# Altium project Backend.PrjPcb
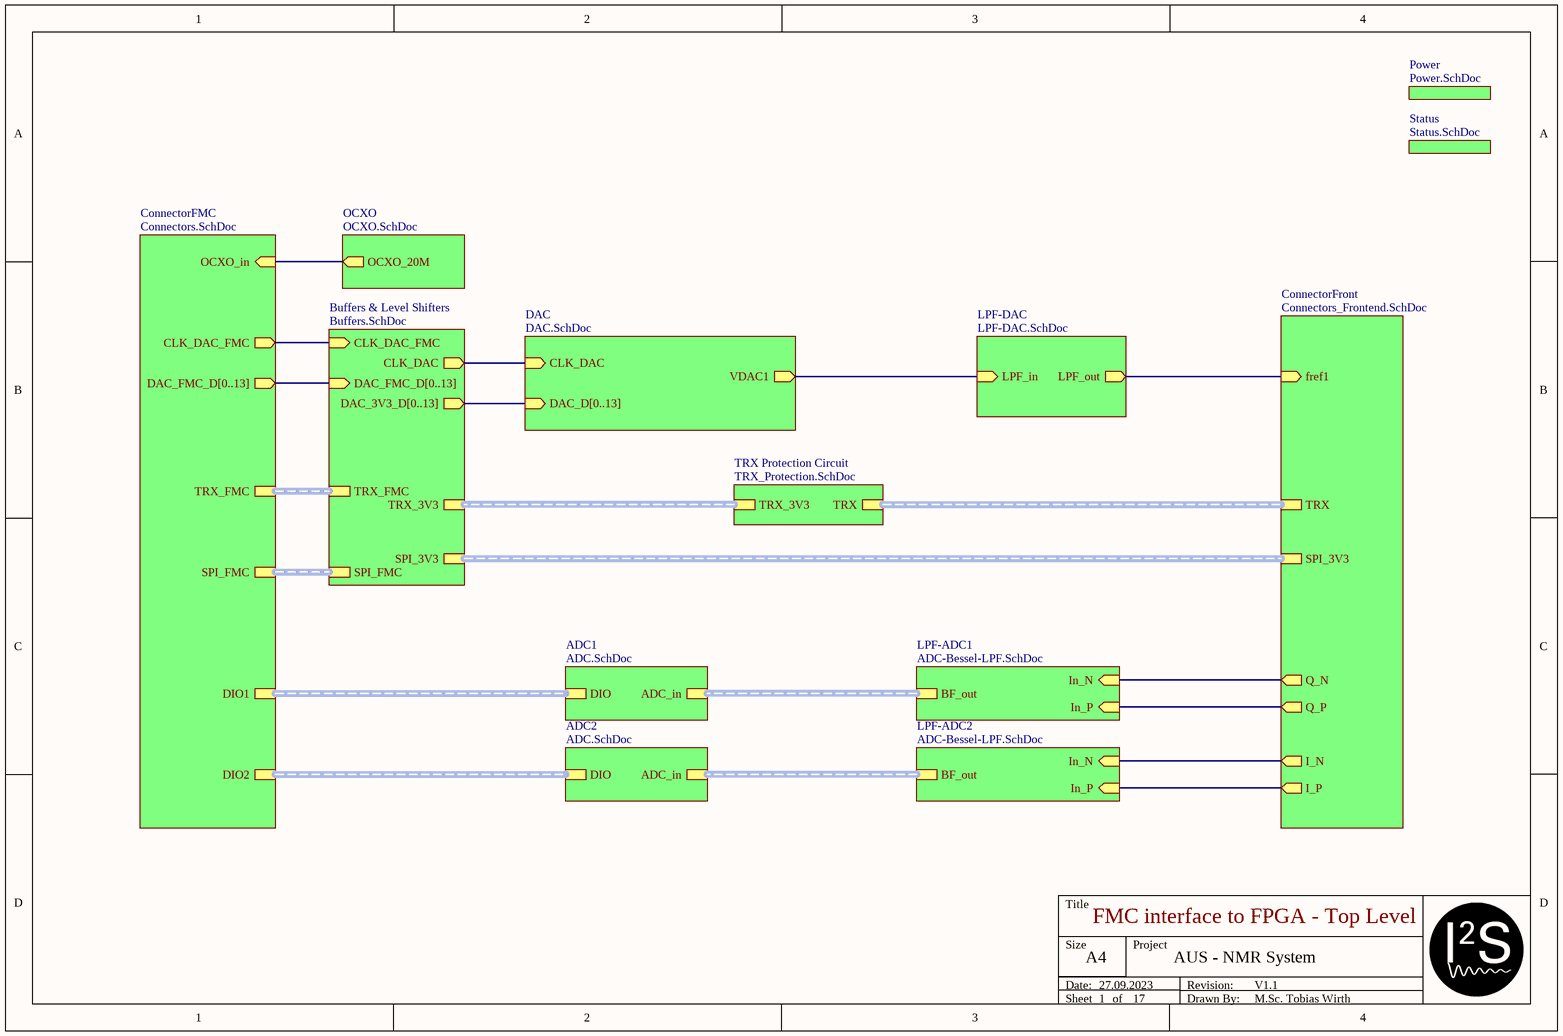
[diagram p0: Top_Level.SchDoc]
CAGE_CODE: ?????; CONTRACT_NUMBER: <CONTRACT NO>; DOC_NO_ASSY_DWG: <ASSY DWG NO>; DOC_NO_BOM: <BOM DOC NO>; DOC_NO_FAB_DWG: <FAB DWG NO>; DOC_NO_SCH_DWG: <SCH DWG NO>; PCB_2_DEC_TOL: +/-.01; PCB_3_DEC_TOL: +/-.010; PCB_ANG_TOL: +/-1/2; PCB_ASSEMBLY_NO: <PCB ASSY NO>; PCB_CHECKER: - -----; PCB_CHECKER_APP_DATE: --/--/----; PCB_DESIGNER: - -----; PCB_DESIGNER_APP_DATE: --/--/----; PCB_DWG_NO: <PCB DWG NO>; PCB_ENGINEER: - -----; PCB_ENGINEER_APP_DATE: --/--/----; PCB_PART_NUMBER: <PCB PN>; PCB_REV: A; SCH_REV: A
9 sheets, 192 parts. Net scope: hierarchical (ports join the sheet entries above them; power ports are global).
Board files: Backend_v2.PcbDoc, Backend_v3.PcbDoc
Sheets:
  Top_Level.SchDoc
    DAC = DAC.SchDoc
    ConnectorFront = Connectors_Frontend.SchDoc
    LPF-ADC2 = ADC-Bessel-LPF.SchDoc
    LPF-ADC1 = ADC-Bessel-LPF.SchDoc
    ADC2 = ADC.SchDoc
    ADC1 = ADC.SchDoc
    Buffers & Level Shifters = Buffers.SchDoc
  DAC-Butterworth-LPF.SchDoc
  DAC-Bessel-LPF.SchDoc
  Power_FE.SchDoc

## Sheet Top_Level.SchDoc: FMC interface to FPGA - Top Level
size A4; Date: 27.09.2023; ApprovedBy: M.Sc. Tobias Wirth; CheckedBy: M.Sc. Tobias Wirth; Author: M.Sc. Tobias Wirth; CompanyName: University of Stuttgart; DrawnBy: M.Sc. Tobias Wirth; Engineer: M.Sc. Tobias Wirth; Organization: IIS; Address1: Pfaffenwaldring 47; Address2: 70569 Stuttgart; Revision: V1.1; SheetNumber: 1; SheetTotal: 17; ProjectNameAlt: AUS - NMR System; Time: 10:00; ImagePath: N/A; Application_BuildNumber: N/A

### Sub-sheets
ADC1 = ADC.SchDoc: DIO (harness DIO), ADC_in (harness ADC_IN)
ADC2 = ADC.SchDoc: DIO (harness DIO), ADC_in (harness ADC_IN)
Buffers & Level Shifters = Buffers.SchDoc: DAC_FMC_D[0..13] (in), CLK_DAC_FMC (in), TRX_FMC (harness TRX_FMC), SPI_FMC (harness SPI_FMC), CLK_DAC (out), DAC_3V3_D[0..13] (out), TRX_3V3 (harness TRX_3V3), SPI_3V3 (harness SPI_3V3)
ConnectorFMC = Connectors.SchDoc (file not in this document): DIO1 (harness DIO), DIO2 (harness DIO), DAC_FMC_D[0..13] (out), CLK_DAC_FMC (out), OCXO_in (in), TRX_FMC (harness TRX_FMC), SPI_FMC (harness SPI_FMC)
ConnectorFront = Connectors_Frontend.SchDoc: fref1 (in), Q_P (out), Q_N (out), I_P (out), I_N (out), TRX (harness TRX), SPI_3V3 (harness SPI_3V3)
DAC = DAC.SchDoc: VDAC1 (out), CLK_DAC (in), DAC_D[0..13] (in)
LPF-ADC1 = ADC-Bessel-LPF.SchDoc: In_N (in), BF_out (harness ADC_IN), In_P (in)
LPF-ADC2 = ADC-Bessel-LPF.SchDoc: In_N (in), BF_out (harness ADC_IN), In_P (in)
LPF-DAC = LPF-DAC.SchDoc (file not in this document): LPF_out (out), LPF_in (in)
OCXO = OCXO.SchDoc (file not in this document): OCXO_20M (out)
Power = Power.SchDoc (file not in this document): no entries
Status = Status.SchDoc (file not in this document): no entries
TRX Protection Circuit = TRX_Protection.SchDoc (file not in this document): TRX_3V3 (harness TRX_3V3), TRX (harness TRX)

### Nets
CLK_DAC_FMC: sheet ConnectorFMC/CLK_DAC_FMC, sheet Buffers & Level Shifters/CLK_DAC_FMC
FREF: sheet LPF-DAC/LPF_out, sheet ConnectorFront/fref1
I_N: sheet ConnectorFront/I_N, sheet LPF-ADC2/In_N
I_P: sheet ConnectorFront/I_P, sheet LPF-ADC2/In_P
Q_N: sheet ConnectorFront/Q_N, sheet LPF-ADC1/In_N
Q_P: sheet ConnectorFront/Q_P, sheet LPF-ADC1/In_P
NetR2_2: sheet DAC/VDAC1, sheet LPF-DAC/LPF_in
NetR4_1: sheet DAC/CLK_DAC, sheet Buffers & Level Shifters/CLK_DAC
(unnamed): sheet ConnectorFMC/OCXO_in, sheet OCXO/OCXO_20M

### Buses and harness runs
bus sheet Buffers & Level Shifters/DAC_3V3_D[0..13] = sheet DAC/DAC_D[0..13]
bus sheet Buffers & Level Shifters/DAC_FMC_D[0..13] = sheet ConnectorFMC/DAC_FMC_D[0..13]
harness sheet ADC1/ADC_in = sheet LPF-ADC1/BF_out
harness sheet ADC1/DIO = sheet ConnectorFMC/DIO1
harness sheet ADC2/ADC_in = sheet LPF-ADC2/BF_out
harness sheet ADC2/DIO = sheet ConnectorFMC/DIO2
harness sheet Buffers & Level Shifters/SPI_3V3 = sheet ConnectorFront/SPI_3V3
harness sheet Buffers & Level Shifters/SPI_FMC = sheet ConnectorFMC/SPI_FMC
harness sheet Buffers & Level Shifters/TRX_3V3 = sheet TRX Protection Circuit/TRX_3V3
harness sheet Buffers & Level Shifters/TRX_FMC = sheet ConnectorFMC/TRX_FMC
harness sheet ConnectorFront/TRX = sheet TRX Protection Circuit/TRX

### Notes on the sheet
- Title
- Size
- Date:
- Sheet
- A4
- of
- Project
- Drawn By:
- Revision:

## Sheet DAC.SchDoc: Digital to Analog Converter
size A4; Date: 27.09.2023; ApprovedBy: M.Sc. Tobias Wirth; CheckedBy: M.Sc. Tobias Wirth; Author: M.Sc. Tobias Wirth; CompanyName: University of Stuttgart; DrawnBy: M.Sc. Tobias Wirth; Engineer: M.Sc. Tobias Wirth; Organization: IIS; Address1: Pfaffenwaldring 47; Address2: 70569 Stuttgart; Revision: V1.5; SheetNumber: 5; SheetTotal: 17; ProjectNameAlt: AUS - NMR System; Time: 15:20; ImagePath: N/A; Application_BuildNumber: N/A
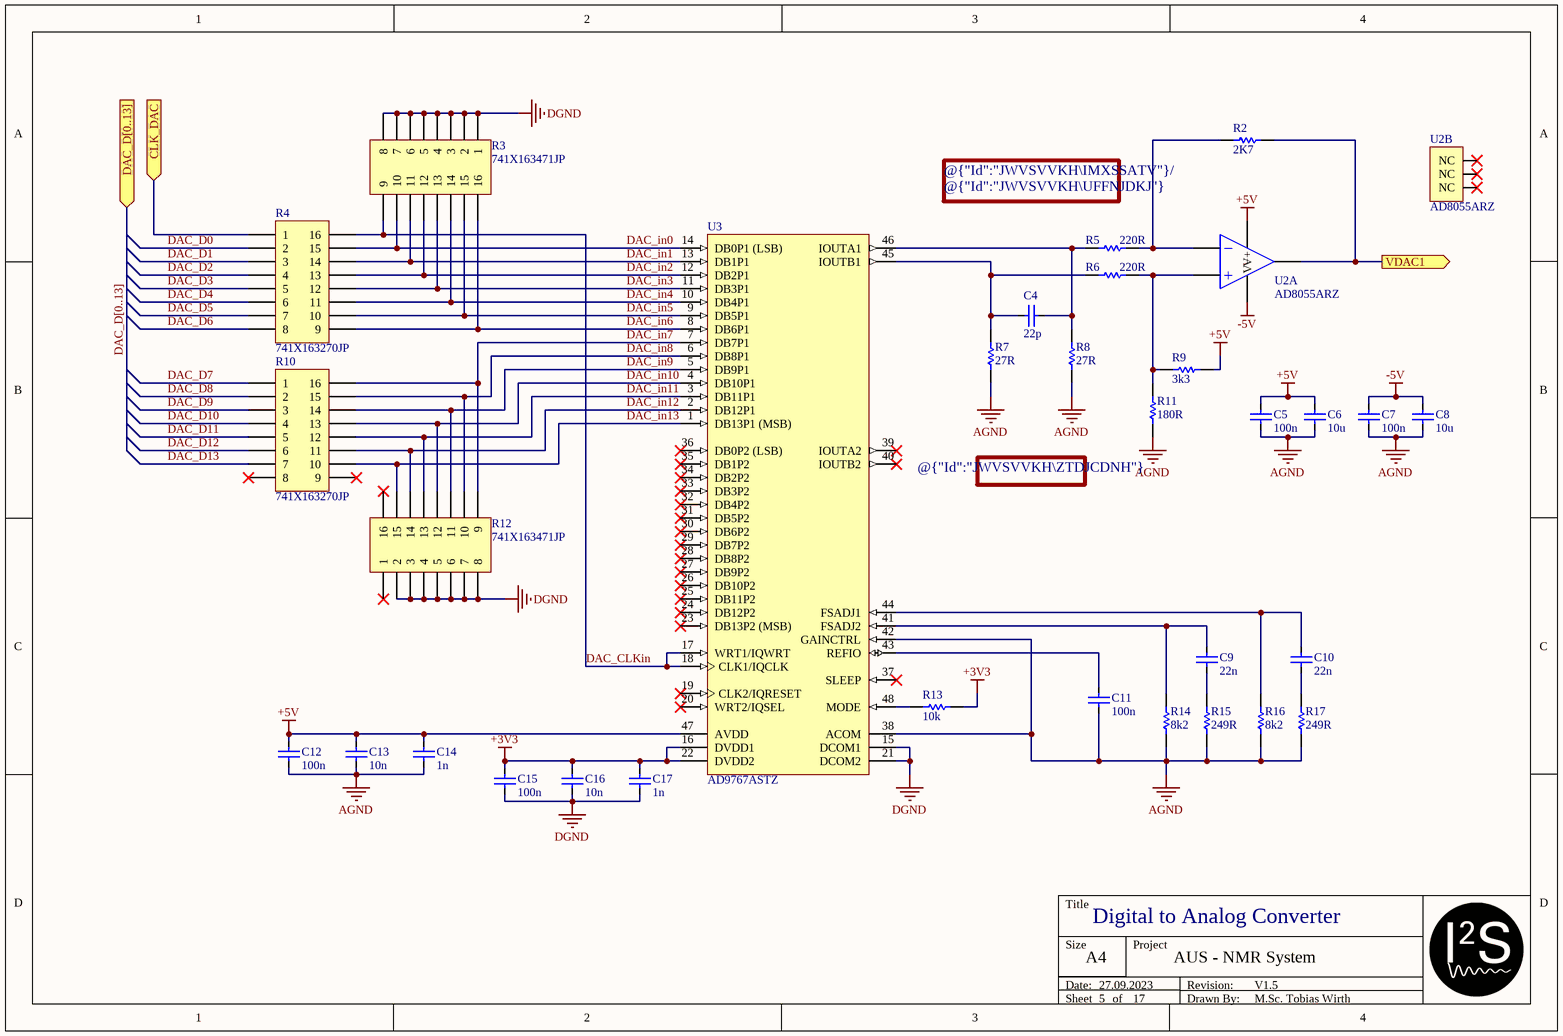
[diagram p1: DAC.SchDoc]

### Parts
C4  22p  [CAP_0402]
C5  100n  [CAP_0402]
C6  10u  [CAP_0603]
C7  100n  [CAP_0402]
C8  10u  [CAP_0603]
C9  22n  [CAP_0402]
C10  22n  [CAP_0402]
C11  100n  [CAP_0402]
C12  100n  [CAP_0402]
C13  10n  [CAP_0402]
C14  1n  [CAP_0402]
C15  100n  [CAP_0402]
C16  10n  [CAP_0402]
C17  1n  [CAP_0402]
R2  2K7  [RES_0402]
R3  741X163471JP  [741X163]
R4  741X163270JP  [741X163]
R5  220R  [RES_0402]
R6  220R  [RES_0402]
R7  27R  [RES_0402]
R8  27R  [RES_0402]
R9  3k3  [RES_0402]
R10  741X163270JP  [741X163]
R11  180R  [RES_0402]
R12  741X163471JP  [741X163]
R13  10k  [RES_0402]
R14  8k2  [RES_0402]
R15  249R  [RES_0402]
R16  8k2  [RES_0402]
R17  249R  [RES_0402]
U2  AD8055ARZ  [SOIC127P600X175-8N]  (parts A,B of 2)
U3  AD9767ASTZ  [TQFP-48_L]

### Ports
CLK_DAC (in), DAC_D[0..13] (in), VDAC1 (out)

### Nets
+3V3: C15.1 C16.1 C17.1 R13.1 U3.16(DVDD1) U3.22(DVDD2)
+5V: C5.1 C6.1 C12.1 C13.1 C14.1 R9.1 U2.7(V+) U3.47(AVDD)
-5V: C7.1 C8.1 U2.4(V−)
AGND: C5.2 C6.2 C7.2 C8.2 C11.2 C12.2 C13.2 C14.2 R7.1 R8.1 R11.1 R14.1 R15.1 R16.1 R17.1 U3.38(ACOM) U3.42(GAINCTRL)
DGND: C15.2 C16.2 C17.2 R3.1 R3.2 R3.3 R3.4 R3.5 R3.6 R3.7 R3.8 R12.2 R12.3 R12.4 R12.5 R12.6 R12.7 R12.8 U3.15(DCOM1) U3.21(DCOM2)
DAC_CLKin: R3.9 R4.16 U3.17(WRT1/IQWRT) U3.18(CLK1/IQCLK)
DAC_D0: R4.2  [project net DAC_3V3_D0]
DAC_D1: R4.3  [project net DAC_3V3_D1]
DAC_D2: R4.4  [project net DAC_3V3_D2]
DAC_D3: R4.5  [project net DAC_3V3_D3]
DAC_D4: R4.6  [project net DAC_3V3_D4]
DAC_D5: R4.7  [project net DAC_3V3_D5]
DAC_D6: R4.8  [project net DAC_3V3_D6]
DAC_D7: R10.1  [project net DAC_3V3_D7]
DAC_D8: R10.2  [project net DAC_3V3_D8]
DAC_D9: R10.3  [project net DAC_3V3_D9]
DAC_D10: R10.4  [project net DAC_3V3_D10]
DAC_D11: R10.5  [project net DAC_3V3_D11]
DAC_D12: R10.6  [project net DAC_3V3_D12]
DAC_D13: R10.7  [project net DAC_3V3_D13]
DAC_in0: R3.10 R4.15 U3.14(DB0P1_(LSB))
DAC_in1: R3.11 R4.14 U3.13(DB1P1)
DAC_in2: R3.12 R4.13 U3.12(DB2P1)
DAC_in3: R3.13 R4.12 U3.11(DB3P1)
DAC_in4: R3.14 R4.11 U3.10(DB4P1)
DAC_in5: R3.15 R4.10 U3.9(DB5P1)
DAC_in6: R3.16 R4.9 U3.8(DB6P1)
DAC_in7: R10.16 R12.9 U3.7(DB7P1)
DAC_in8: R10.15 R12.10 U3.6(DB8P1)
DAC_in9: R10.14 R12.11 U3.5(DB9P1)
DAC_in10: R10.13 R12.12 U3.4(DB10P1)
DAC_in11: R10.12 R12.13 U3.3(DB11P1)
DAC_in12: R10.11 R12.14 U3.2(DB12P1)
DAC_in13: R10.10 R12.15 U3.1(DB13P1_(MSB))
NetC4_1: C4.1 R5.2 R8.2 U3.46(IOUTA1)
NetC4_2: C4.2 R6.2 R7.2 U3.45(IOUTB1)
NetC9_1: C9.1 R14.2 U3.41(FSADJ2)
NetC9_2: C9.2 R15.2
NetC10_1: C10.1 R16.2 U3.44(FSADJ1)
NetC10_2: C10.2 R17.2
NetC11_1: C11.1 U3.43(REFIO)
NetR2_1: R2.1 R5.1 U2.2(−)
NetR2_2: R2.2 U2.6 ; port VDAC1
NetR4_1: R4.1 ; port CLK_DAC
NetR6_1: R6.1 R9.2 R11.2 U2.3(+)
NetR13_2: R13.2 U3.48(MODE)

Not connected (* = marked no-connect by the designer): R10 8* 9*; R12 1* 16*; U2 1(NC)* 5(NC)* 8(NC)*; U3 19(CLK2/IQRESET)* 20(WRT2/IQSEL)* 23(DB13P2_(MSB))* 24(DB12P2)* 25(DB11P2)* 26(DB10P2)* 27(DB9P2)* 28(DB8P2)* 29(DB7P2)* 30(DB6P2)* 31(DB5P2)* 32(DB4P2)* 33(DB3P2)* 34(DB2P2)* 35(DB1P2)* 36(DB0P2_(LSB))* 37(SLEEP)* 39(IOUTA2)* 40(IOUTB2)*

### Buses and harness runs
bus DAC_D[0..13] = port DAC_D[0..13]

### Notes on the sheet
- @{"Id":"JWVSVVKH\IMXSSATV"}/ @{"Id":"JWVSVVKH\UFFNJDKJ"} sets the gain
  @{"Id":"JWVSVVKH\NLDPBRXG"}/ @{"Id":"JWVSVVKH\IJMLKELA"} sets the DC lvl
- @{"Id":"JWVSVVKH\ZTDJCDNH"} ist optional
- Title
- Size
- Date:
- Sheet
- A4
- of
- Project
- Drawn By:
- Revision:

### Library data of the parts
C4-C17 = Cap: Supplier: *; Part Number: *
  C4: Value: 22p
  C5 C7 C11 C12 C15: Value: 100n
  C6 C8: Value: 10u
  C9 C10: Value: 22n
  C13 C16: Value: 10n
  C14 C17: Value: 1n
R2 R5-R9 R11 R13-R17 = Res: Part Number: *; Supplier: *
  R2: Value: 2K7
  R5 R6: Value: 220R
  R7 R8: Value: 27R
  R9: Value: 3k3
  R11: Value: 180R
  R13: Value: 10k
  R14 R16: Value: 8k2
  R15 R17: Value: 249R
R3 R4 R10 R12 = 741X163: Isolated 8 Resistor Network/Array, Convex, Long Side Terminals; Supplier 1: Mouser
  R3 R12: Supplier Part Number 1: 774-741X163471JP
  R4 R10: Supplier Part Number 1: 774-741X163270JP
U2 = AD8055: 300 MHz Voltage Feedback Amplifier; Supplier 1: Mouser; Supplier Part Number 1: 584-AD8055ARZ
U3 = AD9767: Dual 14-Bit TxDAC+, 125 Msps, -40 to +85 degC, ST-48, Pb-Free, Tray; Manufacturer: Analog Devices; Single Supply: Yes; Resolution (Bits): 14; Settling Time: 35ns; Max V+: 5.5V; Op Pwr Diss: 450mW; # DAC Outputs: 2; ComponentLink2Description: Datasheet; ComponentLink2URL: http://www.analog.com/static/imported-files/data_sheets/AD9763_9765_9767.pdf; ComponentLink4URL: http://www.analog.com/en/digital-to-analog-converters/da-converters/ad9767/products/product.html; ComponentLink4Description: Product URL; Packing: Tray; DatasheetVersion: Rev.G; PackageReference: ST-48; RoHS: Y; Generic Part Number: AD9767; ComponentLink3URL: http://www.analog.com/static/imported-files/packages/PKG_PDF/LQFP%28ST%29/ST_48.pdf; ComponentLink1URL: http://www.analog.com/en/index.html; RevisionNote: Component URL fixed; PartNumber: AD9767ASTZ; Mounting Technology: Surface Mount; PackageVersion: revA; ComponentLink1Description: Manufacturer URL; PackageDescription: 48-Pin Thin Quad Flat Pack 0.5 mm Pitch; ComponentLink3Description: Package Specification; Supplier 1: Digi-Key; Supplier Part Number 1: 505-AD9767ASTZ-ND

## Sheet Connectors_Frontend.SchDoc: Connectors - Frontend
size A4; Date: 28.09.2023; ApprovedBy: M.Sc. Tobias Wirth; CheckedBy: M.Sc. Tobias Wirth; Author: M.Sc. Tobias Wirth; CompanyName: University of Stuttgart; DrawnBy: M.Sc. Tobias Wirth; Engineer: M.Sc. Tobias Wirth; Organization: IIS; Address1: Pfaffenwaldring 47; Address2: 70569 Stuttgart; Revision: V1.2; SheetNumber: 9; SheetTotal: 17; ProjectNameAlt: AUS - NMR System; Time: 13:40; ImagePath: N/A; Application_BuildNumber: N/A
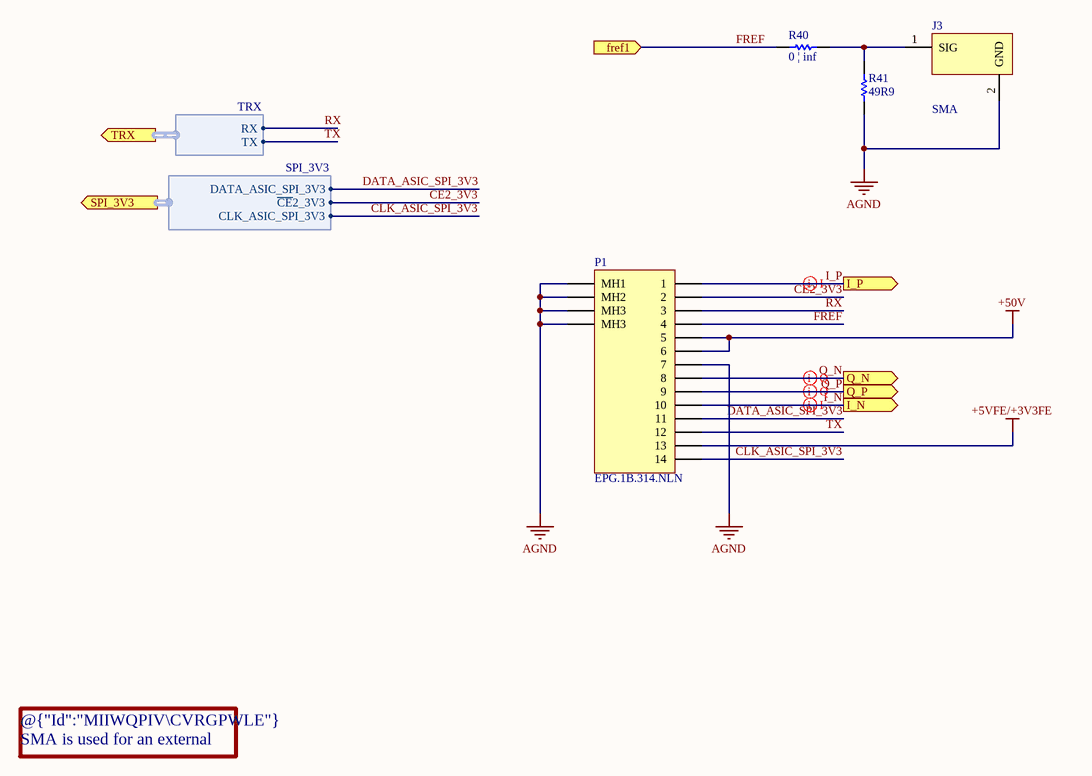
[diagram p2: Connectors_Frontend.SchDoc]

### Parts
J3  SMA  [SMA]
P1  EPG.1B.314.NLN  [EPG.1B.314.NLN]
R40  0 | inf  [RES_0402]
R41  49R9  [RES_0402]

### Ports
fref1 (in), I_N (out), I_P (out), Q_N (out), Q_P (out), SPI_3V3 (out, harness SPI_3V3), TRX (out, harness TRX)

### Harnesses
TRX: TX, RX
SPI_3V3: DATA_ASIC_SPI_3V3, ~{CE}2_3V3, CLK_ASIC_SPI_3V3

### Nets
+5VFE/+3V3FE: P1.13
+50V: P1.5 P1.6
AGND: J3.2(GND) P1.7 P1.15(MH1) P1.16(MH2) P1.17(MH3) P1.18(MH3) R41.1
~{CE}2_3V3: P1.2 ; port SPI_3V3.~{CE}2_3V3
CLK_ASIC_SPI_3V3: P1.14 ; port SPI_3V3.CLK_ASIC_SPI_3V3
DATA_ASIC_SPI_3V3: P1.11 ; port SPI_3V3.DATA_ASIC_SPI_3V3
FREF: P1.4 R40.1 ; port fref1
I_N: P1.10 ; port I_N
I_P: P1.1 ; port I_P
Q_N: P1.8 ; port Q_N
Q_P: P1.9 ; port Q_P
RX: P1.3 ; port TRX.RX
TX: P1.12 ; port TRX.TX
NetJ3_1: J3.1(SIG) R40.2 R41.2

### Layout directives
differential pair; net class LNA_SIG; differential pair class LNA_SIG_Q: Q_N, Q_P
differential pair; differential pair class LNA_SIG_I; net class LNA_SIG: I_N, I_P

### Notes on the sheet
- @{"Id":"MIIWQPIV\CVRGPWLE"} SMA is used for an external reference frequency
- Title
- Size
- Date:
- Sheet
- A4
- of
- Project
- Drawn By:
- Revision:

### Library data of the parts
P1 = EPG.1B.314.NLN: LEMO Connector - 14 pin EPG.1B.314.NLN Elbow receptacle for printed circuit (solder mount), Female Contact Drawing Rev. 00 Source: http://www.lemo.com/catalog/ROW/UK_English/unipole_multipole.pdf
R40 R41 = Res: Part Number: *; Supplier: *
  R40: Value: 0 | inf
  R41: Value: 49R9

## Sheet ADC-Bessel-LPF.SchDoc: Bessel LPF / AAF (350kHz / 14dB)
size A4; Date: 06.10.2023; ApprovedBy: M.Sc. Tobias Wirth; CheckedBy: M.Sc. Tobias Wirth; Author: M.Sc. Tobias Wirth; CompanyName: University of Stuttgart; DrawnBy: M.Sc. Tobias Wirth; Engineer: M.Sc. Tobias Wirth; Organization: IIS; Address1: Pfaffenwaldring 47; Address2: 70569 Stuttgart; Revision: V1.3; SheetNumber: 11; SheetTotal: 17; ProjectNameAlt: AUS - NMR System; Time: 15:00; ImagePath: N/A; Application_BuildNumber: N/A
Used 2 times, as channels LPF-ADC2, LPF-ADC1. Parts and nets are listed once, with the designators drawn on the sheet.
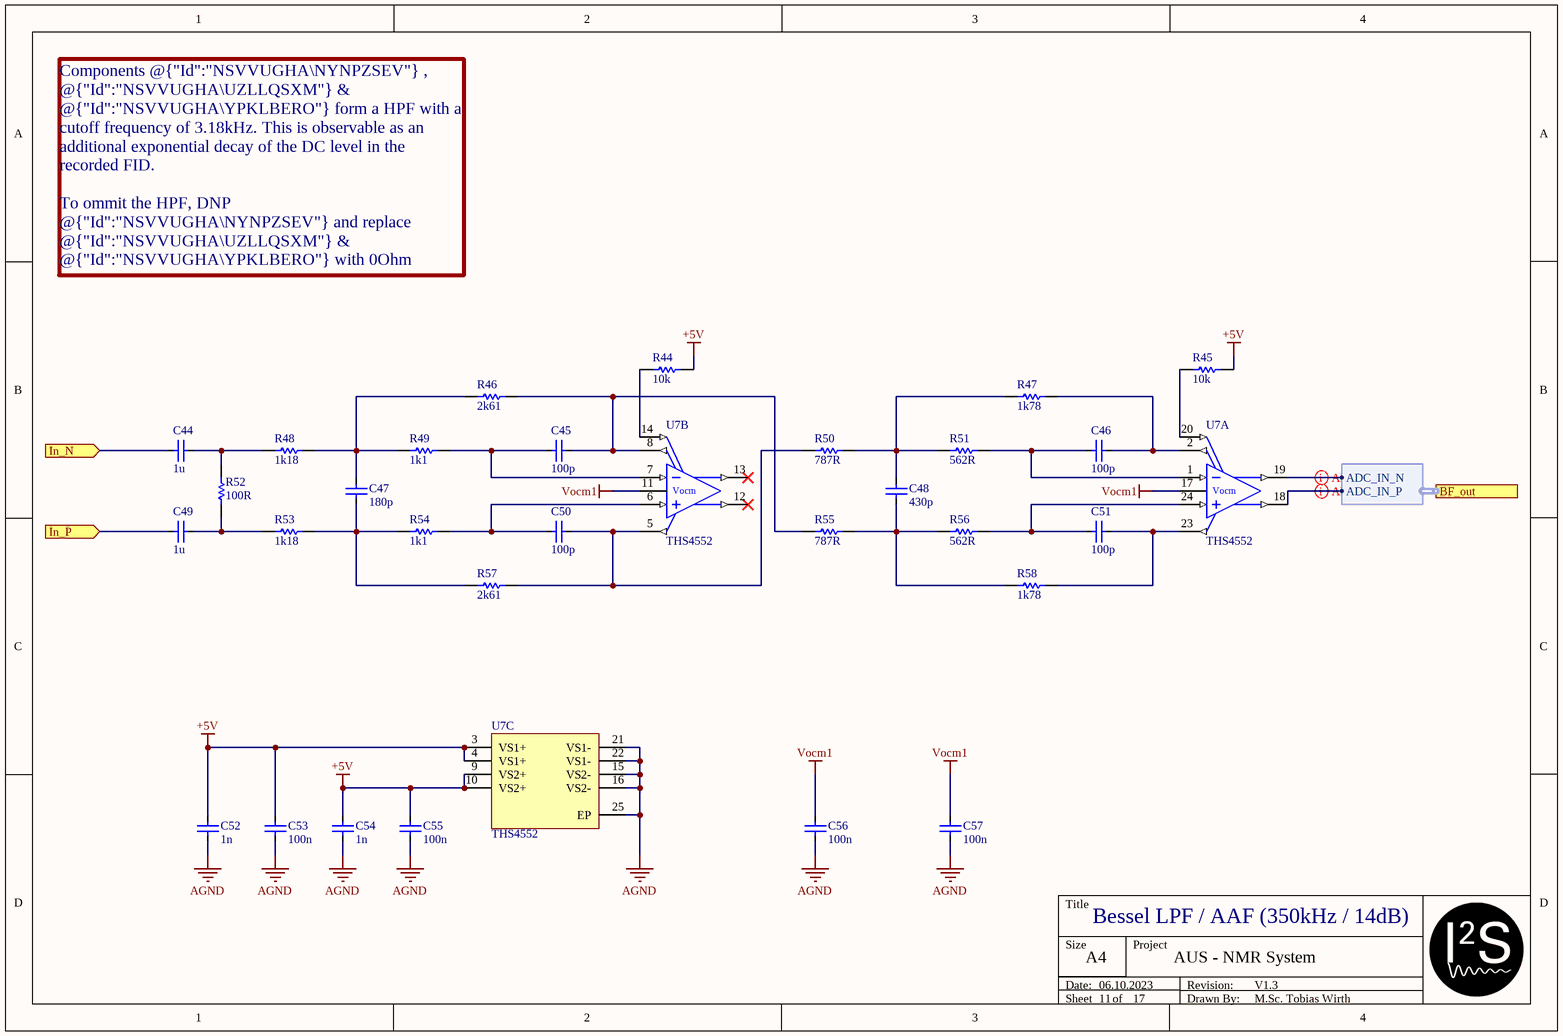
[diagram p3: ADC-Bessel-LPF.SchDoc]

### Parts
C44  1u  [CAP_0402]
C45  100p  [CAP_0402]
C46  100p  [CAP_0402]
C47  180p  [CAP_0402]
C48  430p  [CAP_0402]
C49  1u  [CAP_0402]
C50  100p  [CAP_0402]
C51  100p  [CAP_0402]
C52  1n  [CAP_0402]
C53  100n  [CAP_0402]
C54  1n  [CAP_0402]
C55  100n  [CAP_0402]
C56  100n  [CAP_0402]
C57  100n  [CAP_0402]
R44  10k  [RES_0402]
R45  10k  [RES_0402]
R46  2k61  [RES_0402]
R47  1k78  [RES_0402]
R48  1k18  [RES_0402]
R49  1k1  [RES_0402]
R50  787R  [RES_0402]
R51  562R  [RES_0402]
R52  100R  [RES_0402]
R53  1k18  [RES_0402]
R54  1k1  [RES_0402]
R55  787R  [RES_0402]
R56  562R  [RES_0402]
R57  2k61  [RES_0402]
R58  1k78  [RES_0402]
U7  THS4552  [QFN-24Pin_TP]  (parts A,B,C of 3)

### Ports
BF_out (harness ADC_IN), In_N (in), In_P (in)

### Harnesses
ADC_IN: ADC_IN_N, ADC_IN_P

### Nets
+5V: C52.1 C53.1 C54.1 C55.1 R44.2 R45.2 U7.3(VS1+) U7.4(VS1+) U7.9(VS2+) U7.10(VS2+)
AGND: C52.2 C53.2 C54.2 C55.2 C56.2 C57.2 U7.15(VS2-) U7.16(VS2-) U7.21(VS1-) U7.22(VS1-) U7.25(EP)
Vocm1: C56.1 C57.1 U7.11(VOCM2) U7.17(VOCM1)
In_N: C44.1 ; port In_N
In_P: C49.1 ; port In_P
NetC44_2: C44.2 R48.1 R52.2
NetC45_1: C45.1 R46.2 R55.1 U7.8(FB2+)
NetC45_2: C45.2 R49.2 U7.7(IN2-)
NetC46_1: C46.1 R47.2 U7.2(FB1+)
NetC46_2: C46.2 R51.2 U7.1(IN1-)
NetC47_1: C47.1 R46.1 R48.2 R49.1
NetC47_2: C47.2 R53.2 R54.1 R57.1
NetC48_1: C48.1 R47.1 R50.2 R51.1
NetC48_2: C48.2 R55.2 R56.1 R58.1
NetC49_2: C49.2 R52.1 R53.1
NetC50_1: C50.1 R50.1 R57.2 U7.5(FB2-)
NetC50_2: C50.2 R54.2 U7.6(IN2+)
NetC51_1: C51.1 R58.2 U7.23(FB1-)
NetC51_2: C51.2 R56.2 U7.24(IN1+)
NetR44_1: R44.1 U7.14(~{PD2})
NetR45_1: R45.1 U7.20(~{PD1})
NetU7_18: U7.18(OUT1+) ; port BF_out.ADC_IN_P
NetU7_19: U7.19(OUT1-) ; port BF_out.ADC_IN_N

Not connected (* = marked no-connect by the designer): U7 12(OUT2+)* 13(OUT2-)*

### Channels
LPF-ADC2: designators end in _LPF-ADC2; ports In_N=I_N In_P=I_P
LPF-ADC1: designators end in _LPF-ADC1; ports In_N=Q_N In_P=Q_P

### Layout directives
differential pair; net class ADC_A_IN: ADC_IN_N, ADC_IN_P

### Notes on the sheet
- Components @{"Id":"NSVVUGHA\NYNPZSEV"} , @{"Id":"NSVVUGHA\UZLLQSXM"} & @{"Id":"NSVVUGHA\YPKLBERO"} form a HPF with a cutoff frequency of 3.18kHz. This is observable as an additional exponential decay of the DC level in the recorded FID.
  To ommit the HPF, DNP @{"Id":"NSVVUGHA\NYNPZSEV"} and replace @{"Id":"NSVVUGHA\UZLLQSXM"} & @{"Id":"NSVVUGHA\YPKLBERO"} with 0Ohm resistors.
  Not applicable in combinatiton with LFNMR Gen4 (HB's ASIC) due to its high DC output level. Ommiting the AC coupling / DC block will oversaturate the LPF!
- Title
- Size
- Date:
- Sheet
- A4
- of
- Project
- Drawn By:
- Revision:
- (in symbol THS4552, part A) Vocm
- (in symbol THS4552, part B) Vocm

### Library data of the parts
C44-C57 = Cap: Supplier: *; Part Number: *
  C44 C49: Value: 1u
  C45 C46 C50 C51: Value: 100p
  C47: Value: 180p
  C48: Value: 430p
  C52 C54: Value: 1n
  C53 C55-C57: Value: 100n
R44-R58 = Res: Part Number: *; Supplier: *
  R44 R45: Value: 10k
  R46 R57: Value: 2k61
  R47 R58: Value: 1k78
  R48 R53: Value: 1k18
  R49 R54: Value: 1k1
  R50 R55: Value: 787R
  R51 R56: Value: 562R
  R52: Value: 100R
U7 = THS4552: Dual-Channel, Low-Noise, Precision, 150-MHz, Fully Differential Amplifier; Manufacturer_Name: Texas Instruments; Manufacturer_Part_Number: THS4552IRTWT; Datasheet Link: http://www.ti.com/lit/gpn/THS4552; Height: 0.8mm; Mouser2 Part Number: 595-THS4552IRTWT; Mouser2 Price/Stock: https://www.mouser.com/Search/Refine.aspx?Keyword=595-THS4552IRTWT; Supplier 1: Digi-Key; Supplier Part Number 1: 296-51649-1-ND

## Sheet ADC.SchDoc: Analog to Digital Converter
size A4; Date: 06.10.2023; ApprovedBy: M.Sc. Tobias Wirth; CheckedBy: M.Sc. Tobias Wirth; Author: M.Sc. Tobias Wirth; CompanyName: University of Stuttgart; DrawnBy: M.Sc. Tobias Wirth; Engineer: M.Sc. Tobias Wirth; Organization: IIS; Address1: Pfaffenwaldring 47; Address2: 70569 Stuttgart; Revision: V1.1; SheetNumber: 12; SheetTotal: 17; ProjectNameAlt: AUS - NMR System; Time: 16:00; ImagePath: N/A; Application_BuildNumber: N/A
Used 2 times, as channels ADC2, ADC1. Parts and nets are listed once, with the designators drawn on the sheet.
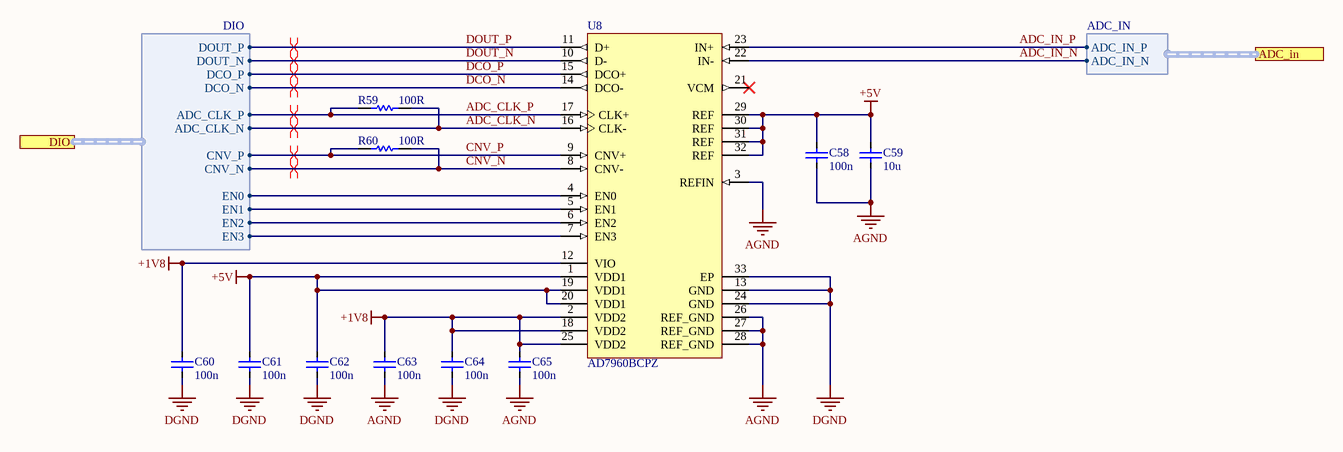
[diagram p4: ADC.SchDoc]

### Parts
C58  100n  [CAP_0402]
C59  10u  [CAP_0603]
C60  100n  [CAP_0402]
C61  100n  [CAP_0402]
C62  100n  [CAP_0402]
C63  100n  [CAP_0402]
C64  100n  [CAP_0402]
C65  100n  [CAP_0402]
R59  100R  [RES_0402]
R60  100R  [RES_0402]
U8  AD7960BCPZ  [ADI-CP-32-7_M]

### Ports
ADC_in (harness ADC_IN), DIO (harness DIO)

### Harnesses
DIO: ADC_CLK_N, ADC_CLK_P, CNV_N, CNV_P, DCO_N, DCO_P, DOUT_N, DOUT_P, EN0, EN1, EN2, EN3
ADC_IN: ADC_IN_P, ADC_IN_N

### Nets
+1V8: C60.1 C63.1 C64.1 C65.1 U8.2(VDD2) U8.12(VIO) U8.18(VDD2) U8.25(VDD2)
+5V: C58.1 C59.1 C61.1 C62.1 U8.1(VDD1) U8.19(VDD1) U8.20(VDD1) U8.29(REF) U8.30(REF) U8.31(REF) U8.32(REF)
AGND: C58.2 C59.2 C63.2 C65.2 U8.3(REFIN) U8.26(REF_GND) U8.27(REF_GND) U8.28(REF_GND)
DGND: C60.2 C61.2 C62.2 C64.2 U8.13(GND) U8.24(GND) U8.33(EP)
ADC_CLK_N: R59.2 U8.16(CLK-) ; port DIO.ADC_CLK_N
ADC_CLK_P: R59.1 U8.17(CLK+) ; port DIO.ADC_CLK_P
ADC_IN_N: U8.22(IN-) ; port ADC_in.ADC_IN_N
ADC_IN_P: U8.23(IN+) ; port ADC_in.ADC_IN_P
CNV_N: R60.2 U8.8(CNV-) ; port DIO.CNV_N
CNV_P: R60.1 U8.9(CNV+) ; port DIO.CNV_P
DCO_N: U8.14(DCO-) ; port DIO.DCO_N
DCO_P: U8.15(DCO+) ; port DIO.DCO_P
DOUT_N: U8.10(D-) ; port DIO.DOUT_N
DOUT_P: U8.11(D+) ; port DIO.DOUT_P
NetU8_4: U8.4(EN0) ; port DIO.EN0
NetU8_5: U8.5(EN1) ; port DIO.EN1
NetU8_6: U8.6(EN2) ; port DIO.EN2
NetU8_7: U8.7(EN3) ; port DIO.EN3

Not connected (* = marked no-connect by the designer): U8 21(VCM)*

### Channels
ADC2: designators end in _ADC2
ADC1: designators end in _ADC1

### Layout directives
differential pair; net class ADC_OUT: ADC_CLK_N_ADC2, ADC_CLK_P_ADC2, CNV_N_ADC2, CNV_P_ADC2, DCO_N_ADC2, DCO_P_ADC2, DOUT_N_ADC2, DOUT_P_ADC2

### Notes on the sheet
- Title
- Size
- Date:
- Sheet
- A4
- of
- Project
- Drawn By:
- Revision:

### Library data of the parts
C58-C65 = Cap: Supplier: *; Part Number: *
  C58 C60-C65: Value: 100n
  C59: Value: 10u
R59 R60 = Res: Part Number: *; Supplier: *; Value: 100R
U8 = AD7960: Single 18-Bit PulSAR Differential Analog-to-Digital Converter with Serial LVDS Interface, 5 MSPS, -40 to 85 degC, CP-32-7, RoHS, Tray; Manufacturer: Analog Devices; Full Power BW: 28 MHz; # of Channels: 1; Throughput Rate: 5 MSPS; Dynamic Range: 100 dB; Resolution: 18 Bits; ComponentLink1Description: Manufacturer URL; ComponentLink3Description: Package Specification; PartNumber: AD7960BCPZ; ComponentLink1URL: http://www.analog.com/en/index.html; ComponentLink2URL: http://www.analog.com/static/imported-files/data_sheets/AD7960.pdf; ComponentLink3URL: http://www.analog.com/static/imported-files/packages/CP_32_7.pdf; RoHS: TRUE; DatasheetVersion: Rev. A; ADC_Sample_Rate: 5 MSPS; Mounting Technology: Surface Mount; Packing: Tray; PackageReference: CP-32-7; Temperature Range: -40 to 85 degC; ComponentLink2Description: Datasheet; PackageDescription: 32-Pin Lead Frame Chip Scale Package, Body 5 x 5 mm, Pitch 0.5 mm; PackageVersion: 112408-A; Supplier 1: Mouser; Supplier Part Number 1: 584-AD7960BCPZ

## Sheet Buffers.SchDoc: Buffers / Level Shifters
size A4; Date: 14.11.2023; ApprovedBy: M.Sc. Tobias Wirth; CheckedBy: M.Sc. Tobias Wirth; Author: M.Sc. Tobias Wirth; CompanyName: University of Stuttgart; DrawnBy: M.Sc. Tobias Wirth; Engineer: M.Sc. Tobias Wirth; Organization: IIS; Address1: Pfaffenwaldring 47; Address2: 70569 Stuttgart; Revision: V0.1; SheetNumber: 3; SheetTotal: 17; ProjectNameAlt: AUS - NMR System; Time: 21:30; ImagePath: N/A; Application_BuildNumber: N/A
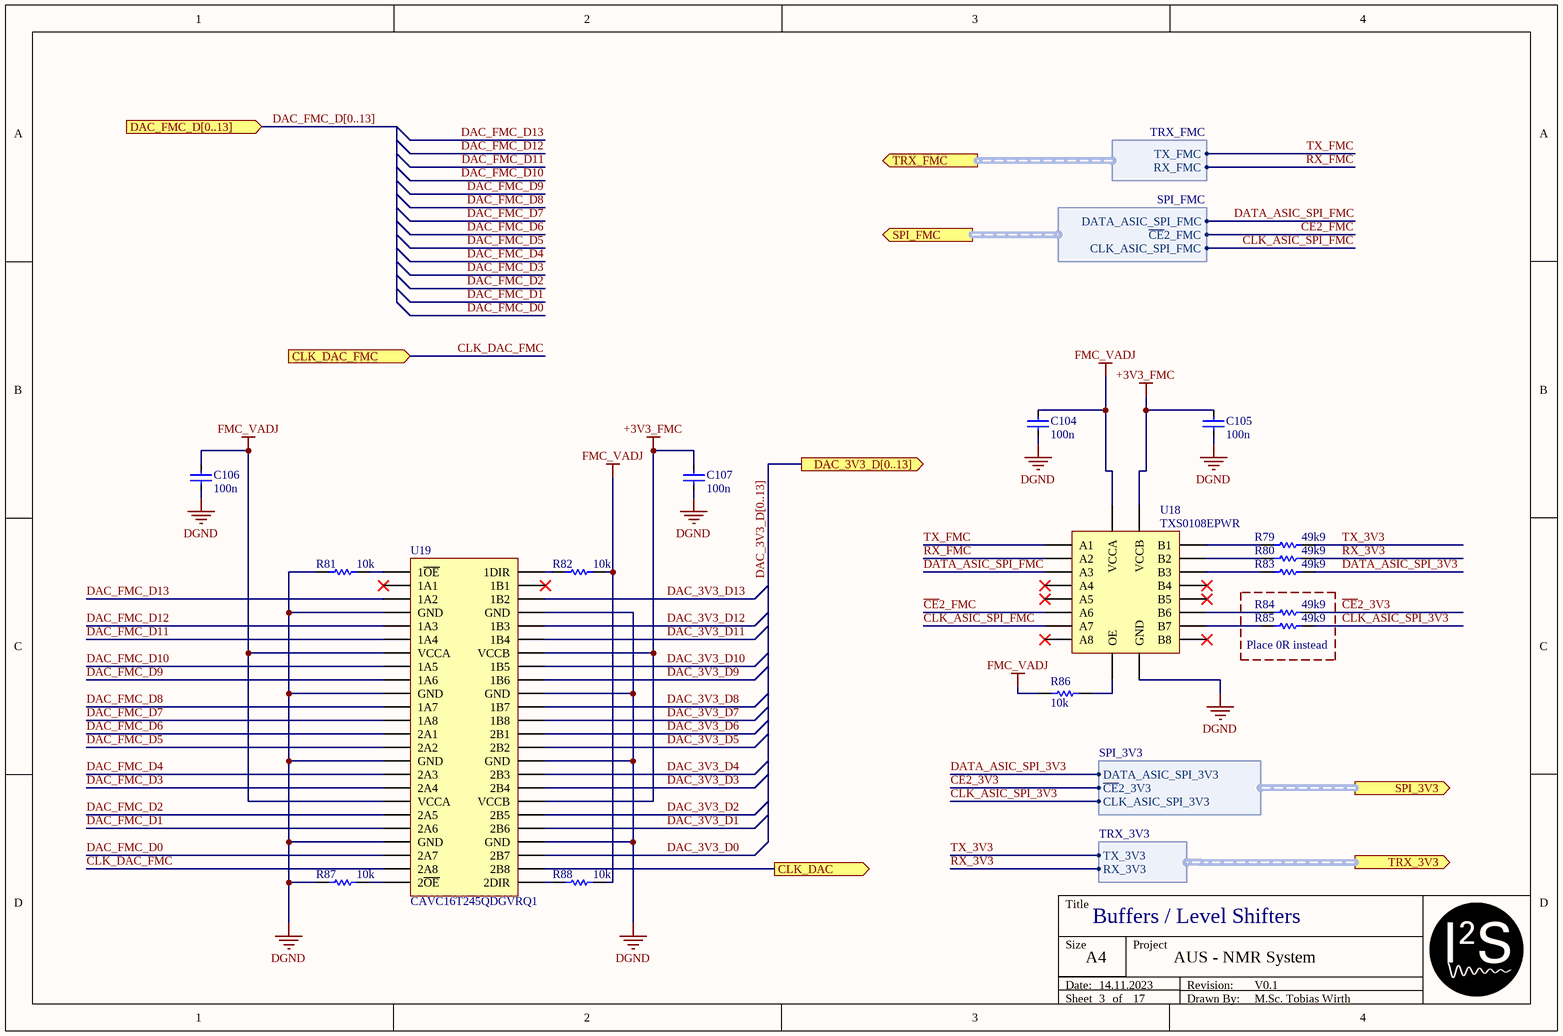
[diagram p5: Buffers.SchDoc]

### Parts
C104  100n  [CAP_0402]
C105  100n  [CAP_0402]
C106  100n  [CAP_0402]
C107  100n  [CAP_0402]
R79  49k9  [RES_0402]
R80  49k9  [RES_0402]
R81  10k  [RES_0402]
R82  10k  [RES_0402]
R83  49k9  [RES_0402]
R84  49k9  [RES_0402]
R85  49k9  [RES_0402]
R86  10k  [RES_0402]
R87  10k  [RES_0402]
R88  10k  [RES_0402]
U18  TXS0108EPWR  [TSSOP-20]
U19  CAVC16T245QDGVRQ1  [TSSOP40P640X120-48N]

### Blocks framed on the sheet
Place 0R instead: R84 R85

### Ports
CLK_DAC (out), CLK_DAC_FMC (in), DAC_3V3_D[0..13] (out), DAC_FMC_D[0..13] (in), SPI_3V3 (out, harness SPI_3V3), SPI_FMC (out, harness SPI_FMC), TRX_3V3 (out, harness TRX_3V3), TRX_FMC (out, harness TRX_FMC)

### Harnesses
SPI_FMC: DATA_ASIC_SPI_FMC, ~{CE}2_FMC, CLK_ASIC_SPI_FMC
TRX_FMC: TX_FMC, RX_FMC
SPI_3V3: DATA_ASIC_SPI_3V3, ~{CE}2_3V3, CLK_ASIC_SPI_3V3
TRX_3V3: TX_3V3, RX_3V3

### Nets
+3V3_FMC: C105.1 C107.1 U18.19(VCCB) U19.7(VCCB) U19.18(VCCB)
DGND: C104.2 C105.2 C106.2 C107.2 R81.2 R87.2 U18.11(GND) U19.4(GND) U19.10(GND) U19.15(GND) U19.21(GND) U19.28(GND) U19.34(GND) U19.39(GND) U19.45(GND)
FMC_VADJ: C104.1 C106.1 R82.1 R86.2 R88.1 U18.2(VCCA) U19.31(VCCA) U19.42(VCCA)
~{CE}2_3V3: R84.2 ; port SPI_3V3.~{CE}2_3V3
~{CE}2_FMC: U18.7(A6) ; port SPI_FMC.~{CE}2_FMC
CLK_ASIC_SPI_3V3: R85.2 ; port SPI_3V3.CLK_ASIC_SPI_3V3
CLK_ASIC_SPI_FMC: U18.8(A7) ; port SPI_FMC.CLK_ASIC_SPI_FMC
CLK_DAC_FMC: U19.26(2A8) ; port CLK_DAC_FMC
DAC_3V3_D0: U19.22(2B7)
DAC_3V3_D1: U19.20(2B6)
DAC_3V3_D2: U19.19(2B5)
DAC_3V3_D3: U19.17(2B4)
DAC_3V3_D4: U19.16(2B3)
DAC_3V3_D5: U19.14(2B2)
DAC_3V3_D6: U19.13(2B1)
DAC_3V3_D7: U19.12(1B8)
DAC_3V3_D8: U19.11(1B7)
DAC_3V3_D9: U19.9(1B6)
DAC_3V3_D10: U19.8(1B5)
DAC_3V3_D11: U19.6(1B4)
DAC_3V3_D12: U19.5(1B3)
DAC_3V3_D13: U19.3(1B2)
DAC_FMC_D0: U19.27(2A7)
DAC_FMC_D1: U19.29(2A6)
DAC_FMC_D2: U19.30(2A5)
DAC_FMC_D3: U19.32(2A4)
DAC_FMC_D4: U19.33(2A3)
DAC_FMC_D5: U19.35(2A2)
DAC_FMC_D6: U19.36(2A1)
DAC_FMC_D7: U19.37(1A8)
DAC_FMC_D8: U19.38(1A7)
DAC_FMC_D9: U19.40(1A6)
DAC_FMC_D10: U19.41(1A5)
DAC_FMC_D11: U19.43(1A4)
DAC_FMC_D12: U19.44(1A3)
DAC_FMC_D13: U19.46(1A2)
DATA_ASIC_SPI_3V3: R83.2 ; port SPI_3V3.DATA_ASIC_SPI_3V3
DATA_ASIC_SPI_FMC: U18.4(A3) ; port SPI_FMC.DATA_ASIC_SPI_FMC
RX_3V3: R80.2 ; port TRX_3V3.RX_3V3
RX_FMC: U18.3(A2) ; port TRX_FMC.RX_FMC
TX_3V3: R79.2 ; port TRX_3V3.TX_3V3
TX_FMC: U18.1(A1) ; port TRX_FMC.TX_FMC
NetR4_1: U19.23(2B8) ; port CLK_DAC
NetR79_1: R79.1 U18.20(B1)
NetR80_1: R80.1 U18.18(B2)
NetR81_1: R81.1 U19.48(1~{OE})
NetR82_2: R82.2 U19.1(1DIR)
NetR83_1: R83.1 U18.17(B3)
NetR84_1: R84.1 U18.14(B6)
NetR85_1: R85.1 U18.13(B7)
NetR86_1: R86.1 U18.10(OE)
NetR87_1: R87.1 U19.25(2~{OE})
NetR88_2: R88.2 U19.24(2DIR)

Not connected (* = marked no-connect by the designer): U18 5(A4)* 6(A5)* 9(A8)* 12(B8)* 15(B5)* 16(B4)*; U19 2(1B1)* 47(1A1)*

### Buses and harness runs
bus DAC_3V3_D[0..13] = port DAC_3V3_D[0..13]
bus DAC_FMC_D[0..13] = port DAC_FMC_D[0..13]

### Notes on the sheet
- Title
- Size
- Date:
- Sheet
- A4
- of
- Project
- Drawn By:
- Revision:

### Library data of the parts
C104-C107 = Cap: Supplier: *; Part Number: *; Value: 100n
R79-R88 = Res: Part Number: *; Supplier: *
  R79 R80 R83-R85: Value: 49k9
  R81 R82 R86-R88: Value: 10k
U18 = TXS0108EPWR: 8-Bit Bi-directional, Level-Shifting, Voltage Translator for Open-Drain and Push-Pull Applications; Supplier 1: Mouser; Supplier Part Number 1: 595-TXS0108EPWR
U19 = CAVC16T245QDGVRQ1: 16-Bit Dual-Supply Bus Transceiver With Configurable Voltage Translation and 3-State Outputs; Supplier 1: Mouser; Supplier Part Number 1: 595-AVC16T245QDGVRQ1

## Sheet DAC-Butterworth-LPF.SchDoc: Butterworth LPF (12MHz / 0dB)
size A4; Date: 27.09.2023; ApprovedBy: M.Sc. Tobias Wirth; CheckedBy: M.Sc. Tobias Wirth; Author: M.Sc. Tobias Wirth; CompanyName: University of Stuttgart; DrawnBy: M.Sc. Tobias Wirth; Engineer: M.Sc. Tobias Wirth; Organization: IIS; Address1: Pfaffenwaldring 47; Address2: 70569 Stuttgart; Revision: V0.1; SheetNumber: 7; SheetTotal: 17; ProjectNameAlt: AUS - NMR System; Time: 17:40; ImagePath: N/A; Application_BuildNumber: N/A
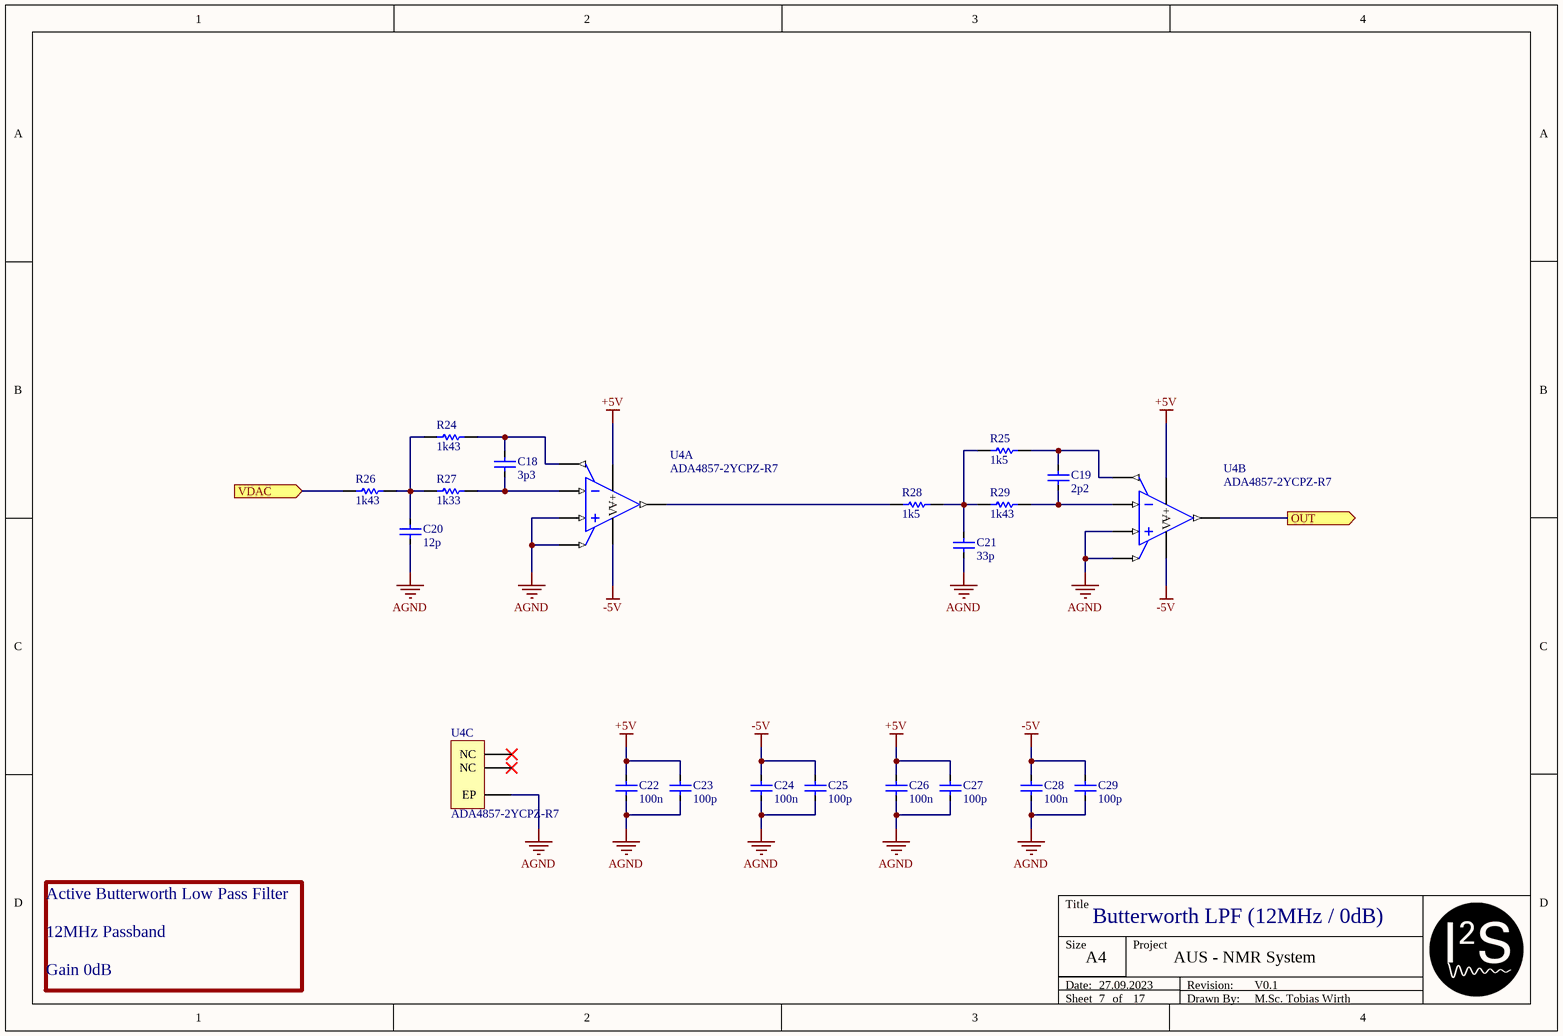
[diagram p6: DAC-Butterworth-LPF.SchDoc]

### Parts
C18  3p3  [CAP_0402]
C19  2p2  [CAP_0402]
C20  12p  [CAP_0402]
C21  33p  [CAP_0402]
C22  100n  [CAP_0402]
C23  100p  [CAP_0402]
C24  100n  [CAP_0402]
C25  100p  [CAP_0402]
C26  100n  [CAP_0402]
C27  100p  [CAP_0402]
C28  100n  [CAP_0402]
C29  100p  [CAP_0402]
R24  1k43  [RES_0402]
R25  1k5  [RES_0402]
R26  1k43  [RES_0402]
R27  1k33  [RES_0402]
R28  1k5  [RES_0402]
R29  1k43  [RES_0402]
U4  ADA4857-2YCPZ-R7  [QFN65P400X400X80_HS-17N]  (parts A,B,C of 3)

### Ports
OUT (out), VDAC (in)

### Nets
+5V: C22.1 C23.1 C26.1 C27.1 U4.6(V+) U4.14(V+)
-5V: C24.1 C25.1 C28.1 C29.1 U4.4(V−) U4.12(V−)
AGND: C20.2 C21.2 C22.2 C23.2 C24.2 C25.2 C26.2 C27.2 C28.2 C29.2 U4.2(IN1+) U4.7(PD1) U4.10(IN1+) U4.15(PD1) U4.17(EP)
NetC18_1: C18.1 R24.2 U4.16(FB1)
NetC18_2: C18.2 R27.2 U4.1(IN1-)
NetC19_1: C19.1 R25.2 U4.8(FB2)
NetC19_2: C19.2 R29.2 U4.9(IN1-)
NetC20_1: C20.1 R24.1 R26.2 R27.1
NetC21_1: C21.1 R25.1 R28.2 R29.1
NetR26_1: R26.1 ; port VDAC
NetR28_1: R28.1 U4.13(OUT1)
NetU4_5: U4.5(OUT2) ; port OUT

Not connected (* = marked no-connect by the designer): U4 3(NC)* 11(NC)*

### Notes on the sheet
- Active Butterworth Low Pass Filter
  12MHz Passband
  Gain 0dB
- Title
- Size
- Date:
- Sheet
- A4
- of
- Project
- Drawn By:
- Revision:

### Library data of the parts
C18-C29 = Cap: Supplier: *; Part Number: *
  C18: Value: 3p3
  C19: Value: 2p2
  C20: Value: 12p
  C21: Value: 33p
  C22 C24 C26 C28: Value: 100n
  C23 C25 C27 C29: Value: 100p
R24-R29 = Res: Part Number: *; Supplier: *
  R24 R26 R29: Value: 1k43
  R25 R28: Value: 1k5
  R27: Value: 1k33
U4 = ADA4857-2: Ultralow Power, Low Distortion Fully Differential ADC Driver, 3 to 7 V, -40 to 125 degC, 16-Pin LFCSP_WQ (CP-24-7), RoHS, Reel; Manufacturer: Analog Devices; PartNumber: ADA4940-2ACPZ-R2; Iq/Amp: 1.25 mA Typ.; Slew Rate: 95 V/us Typ.; Test Frequency: 0.05 MHz; -3dB Bandwidth: 260 MHz Typ.; Operating Range: 3 to 7 V; ComponentLink3Description: Package Specification; ComponentLink2Description: Datasheet; RoHS: TRUE; ComponentLink2URL: http://www.analog.com/static/imported-files/data_sheets/ADA4940-1_4940-2.pdf; PackageVersion: Apr-12; DatasheetVersion: Rev. C; PackageDescription: 24-Pin Lead Frame Chip Scale Package, Body 4 x 4 mm, Pitch 0.5 mm; ComponentLink1Description: Manufacturer URL; ComponentLink1URL: http://www.analog.com/en/index.html; Packing: Reel; ComponentLink3URL: http://www.analog.com/static/imported-files/packages/PKG_PDF/LFCSP(CP)/CP_24_7.pdf; Temperature Range: -40 to 125 degC; Mounting Technology: Surface Mount; PartId: 1; Supplier 1: Mouser; Supplier Part Number 1: 584-ADA4857-2YCPZ-R7

## Sheet DAC-Bessel-LPF.SchDoc: Bessel LPF (4MHz / 0dB)
size A4; Date: 27.09.2023; ApprovedBy: M.Sc. Tobias Wirth; CheckedBy: M.Sc. Tobias Wirth; Author: M.Sc. Tobias Wirth; CompanyName: University of Stuttgart; DrawnBy: M.Sc. Tobias Wirth; Engineer: M.Sc. Tobias Wirth; Organization: IIS; Address1: Pfaffenwaldring 47; Address2: 70569 Stuttgart; Revision: V1.1; SheetNumber: 8; SheetTotal: 17; ProjectNameAlt: AUS - NMR System; Time: 19:10; ImagePath: N/A; Application_BuildNumber: N/A
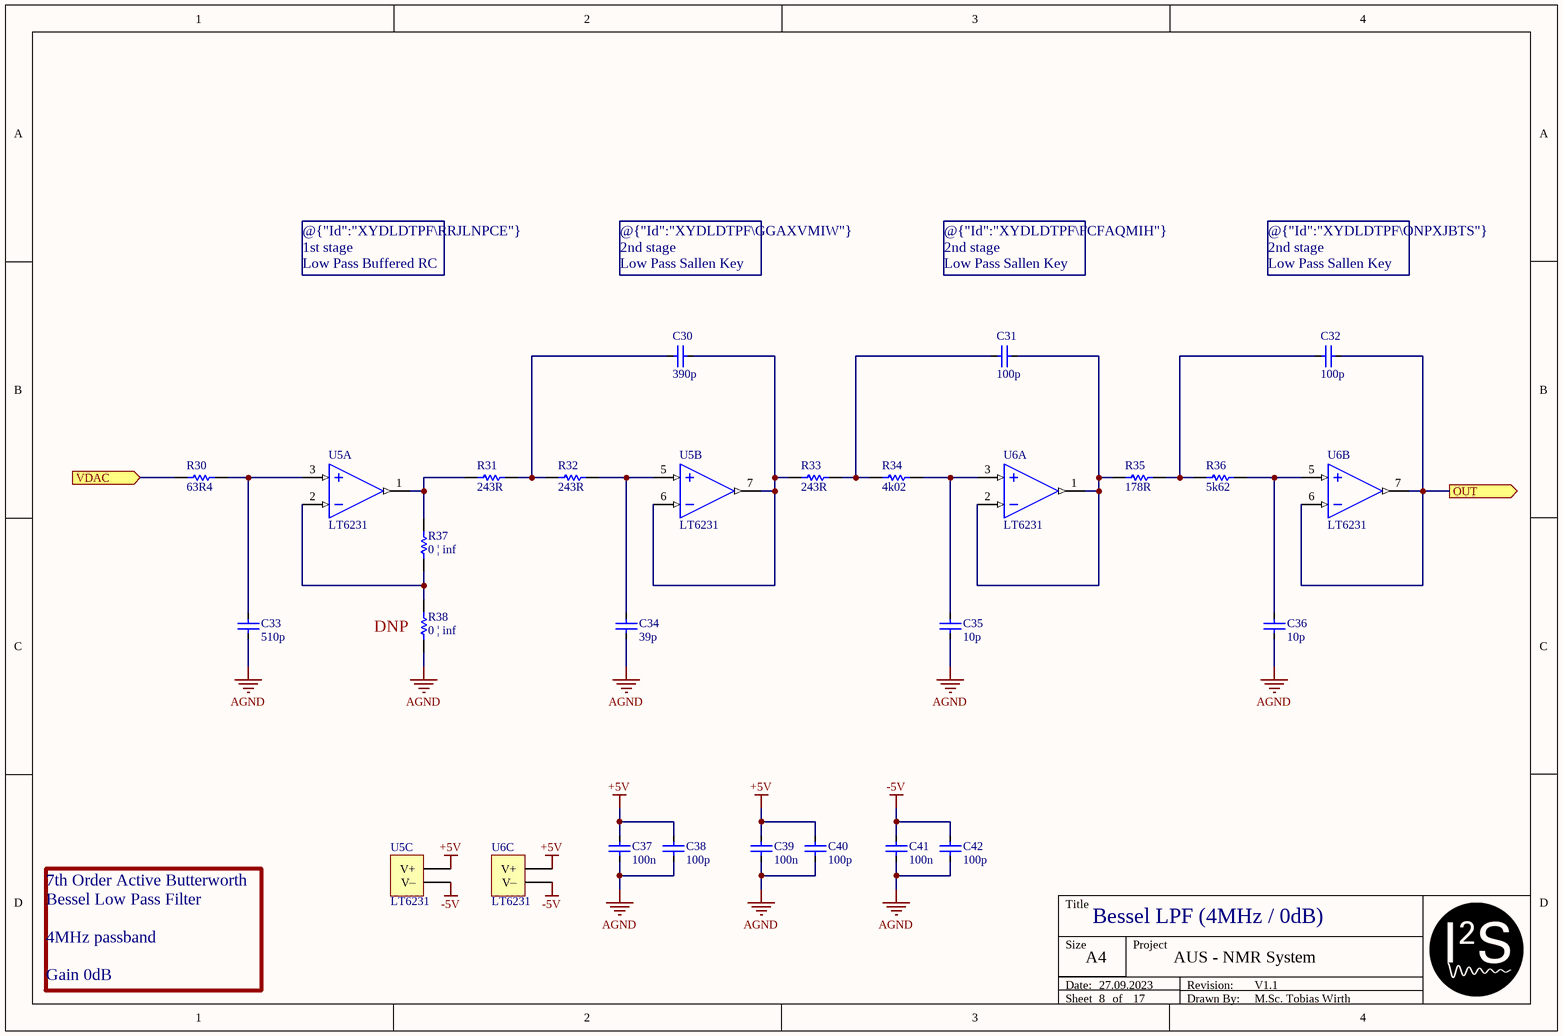
[diagram p7: DAC-Bessel-LPF.SchDoc]

### Parts
C30  390p  [CAP_0402]
C31  100p  [CAP_0402]
C32  100p  [CAP_0402]
C33  510p  [CAP_0402]
C34  39p  [CAP_0402]
C35  10p  [CAP_0402]
C36  10p  [CAP_0402]
C37  100n  [CAP_0402]
C38  100p  [CAP_0402]
C39  100n  [CAP_0402]
C40  100p  [CAP_0402]
C41  100n  [CAP_0402]
C42  100p  [CAP_0402]
R30  63R4  [RES_0402]
R31  243R  [RES_0402]
R32  243R  [RES_0402]
R33  243R  [RES_0402]
R34  4k02  [RES_0402]
R35  178R  [RES_0402]
R36  5k62  [RES_0402]
R37  0 | inf  [RES_0402]
R38  0 | inf  [RES_0402]
U5  LT6231  [SOP127P600X175-8N]  (parts A,B,C of 3)
U6  LT6231  [SOP127P600X175-8N]  (parts A,B,C of 3)

### Ports
OUT (out), VDAC (in)

### Nets
+5V: C37.1 C38.1 C39.1 C40.1 U5.8(V+) U6.8(V+)
-5V: C41.1 C42.1 U5.4(V–) U6.4(V–)
AGND: C33.2 C34.2 C35.2 C36.2 C37.2 C38.2 C39.2 C40.2 C41.2 C42.2 R38.1
NetC30_1: C30.1 R31.2 R32.1
NetC30_2: C30.2 R33.1 U5.6(IN1-) U5.7(OUT2)
NetC31_1: C31.1 R33.2 R34.1
NetC31_2: C31.2 R35.1 U6.1(OUT1) U6.2(IN1-)
NetC32_1: C32.1 R35.2 R36.1
NetC32_2: C32.2 U6.6(IN1-) U6.7(OUT2) ; port OUT
NetC33_1: C33.1 R30.2 U5.3(IN1+)
NetC34_1: C34.1 R32.2 U5.5(IN1+)
NetC35_1: C35.1 R34.2 U6.3(IN1+)
NetC36_1: C36.1 R36.2 U6.5(IN1+)
NetR30_1: R30.1 ; port VDAC
NetR31_1: R31.1 R37.2 U5.1(OUT1)
NetR37_1: R37.1 R38.2 U5.2(IN1-)

### Notes on the sheet
- @{"Id":"XYDLDTPF\RRJLNPCE"}
  1st stage
  Low Pass Buffered RC
- @{"Id":"XYDLDTPF\GGAXVMIW"}
  2nd stage
  Low Pass Sallen Key
- @{"Id":"XYDLDTPF\FCFAQMIH"}
  2nd stage
  Low Pass Sallen Key
- @{"Id":"XYDLDTPF\ONPXJBTS"}
  2nd stage
  Low Pass Sallen Key
- (near R38) DNP
- 7th Order Active Butterworth Bessel Low Pass Filter
  4MHz passband
  Gain 0dB
- Title
- Size
- Date:
- Sheet
- A4
- of
- Project
- Drawn By:
- Revision:

### Library data of the parts
C30-C42 = Cap: Supplier: *; Part Number: *
  C30: Value: 390p
  C31 C32 C38 C40 C42: Value: 100p
  C33: Value: 510p; Supplier 1: Digi-Key; Supplier Part Number 1: 490-GCM1555C1H511FA16DCT-ND
  C34: Value: 39p
  C35 C36: Value: 10p
  C37 C39 C41: Value: 100n
R30-R38 = Res: Part Number: *; Supplier: *
  R30: Value: 63R4; Supplier 1: Digi-Key; Supplier Part Number 1: RT0402FRE0763R4L-ND
  R31-R33: Value: 243R
  R34: Value: 4k02
  R35: Value: 178R
  R36: Value: 5k62
  R37 R38: Value: 0 | inf
U5 U6 = LT6231: 215MHz, Rail-to-Rail Output, 1.1nV/√Hz, 3.5mA Op Amp Family; Supplier 1: Mouser; Supplier Part Number 1: 584-LT6231IS8#PBF

## Sheet Power_FE.SchDoc: PDN - Frontend
size A4; Date: 06.10.2023; ApprovedBy: M.Sc. Tobias Wirth; CheckedBy: M.Sc. Tobias Wirth; Author: M.Sc. Tobias Wirth; CompanyName: University of Stuttgart; DrawnBy: M.Sc. Tobias Wirth; Engineer: M.Sc. Tobias Wirth; Organization: IIS; Address1: Pfaffenwaldring 47; Address2: 70569 Stuttgart; Revision: V0.1; SheetNumber: 17; SheetTotal: 17; ProjectNameAlt: AUS - NMR System; Time: 17:30; ImagePath: N/A; Application_BuildNumber: N/A
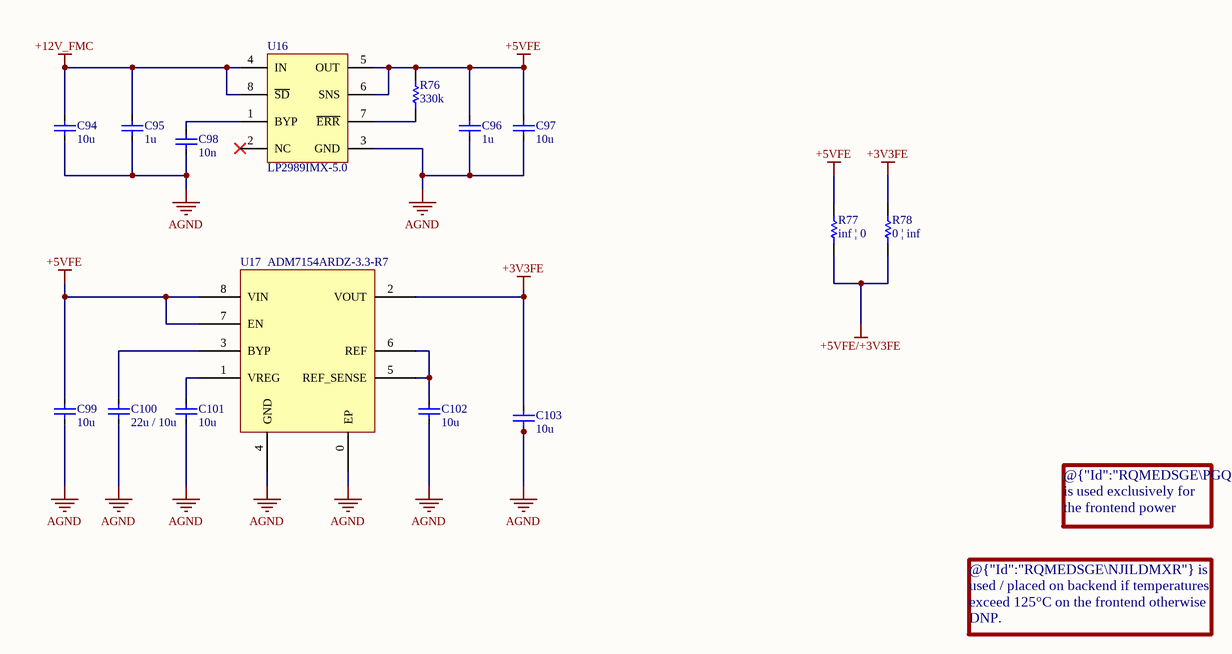
[diagram p8: Power_FE.SchDoc]

### Parts
C94  10u  [CAP_0603]
C95  1u  [CAP_0402]
C96  1u  [CAP_0402]
C97  10u  [CAP_0603]
C98  10n  [CAP_0402]
C99  10u  [CAP_0603]
C100  22u / 10u  [CAP_0603]
C101  10u  [CAP_0603]
C102  10u  [CAP_0603]
C103  10u  [CAP_0603]
R76  330k  [RES_0402]
R77  inf | 0  [RES_0402]
R78  0 | inf  [RES_0402]
U16  LP2989IMX-5.0  [SOP127P600X175-8N]
U17  ADM7154ARDZ-3.3-R7  [SOIC-8_TP - TW]

### Nets
+3V3FE: C103.1 R78.2 U17.2(VOUT)
+5VFE: C96.1 C97.1 C99.1 R76.2 R77.2 U16.5(OUT) U16.6(SNS) U17.7(EN) U17.8(VIN)
+5VFE/+3V3FE: R77.1 R78.1
+12V_FMC: C94.1 C95.1 U16.4(IN) U16.8(~{SD})
AGND: C94.2 C95.2 C96.2 C97.2 C98.2 C99.2 C100.2 C101.2 C102.2 C103.2 U16.3(GND) U17.0(EP) U17.4(GND)
NetC98_1: C98.1 U16.1(BYP)
NetC100_1: C100.1 U17.3(BYP)
NetC101_1: C101.1 U17.1(VREG)
NetC102_1: C102.1 U17.5(REF_SENSE) U17.6(REF)
NetR76_1: R76.1 U16.7(~{ERR})

Not connected (* = marked no-connect by the designer): U16 2(NC)*

### Notes on the sheet
- @{"Id":"RQMEDSGE\PGQLPKLV"} is used exclusively for the frontend power supply
- @{"Id":"RQMEDSGE\NJILDMXR"} is used / placed on backend if temperatures exceed 125°C on the frontend otherwise DNP.
  Also choose @{"Id":"RQMEDSGE\KBXZODYW"} & @{"Id":"RQMEDSGE\DOAMLQUF"} accordingly.
- Title
- Size
- Date:
- Sheet
- A4
- of
- Project
- Drawn By:
- Revision:

### Library data of the parts
C94-C103 = Cap: Supplier: *; Part Number: *
  C94 C97 C99 C101-C103: Value: 10u
  C95 C96: Value: 1u
  C98: Value: 10n
  C100: Value: 22u / 10u
R76-R78 = Res: Part Number: *; Supplier: *
  R76: Value: 330k
  R77: Value: inf | 0
  R78: Value: 0 | inf
U16 = LP2989: Supplier 1: Heisener; Supplier Part Number 1: LP2989IMX-5.0
U17 = ADM715X: Supplier 1: Mouser; Supplier Part Number 1: 584-ADM7154ARDZ3.3R7

## Nets that join several sheets
+1V8: ADC2 (8 pins), ADC1 (8 pins)
+5V: DAC (8 pins), LPF-ADC2 (10 pins), LPF-ADC1 (10 pins), ADC2 (11 pins), ADC1 (11 pins), DAC-Butterworth-LPF (6 pins), DAC-Bessel-LPF (6 pins)
+5VFE/+3V3FE: Connectors_Frontend (P1.13), Power_FE (R77.1 R78.1)
-5V: DAC (C7.1 C8.1 U2.4), DAC-Butterworth-LPF (6 pins), DAC-Bessel-LPF (C41.1 C42.1 U5.4 U6.4)
AGND: DAC (17 pins), Connectors_Frontend (7 pins), LPF-ADC2 (11 pins), LPF-ADC1 (11 pins), ADC2 (8 pins), ADC1 (8 pins), DAC-Butterworth-LPF (15 pins), DAC-Bessel-LPF (11 pins), Power_FE (13 pins)
DGND: DAC (20 pins), ADC2 (7 pins), ADC1 (7 pins), Buffers (15 pins)
Vocm1: LPF-ADC2 (C56_LPF-ADC2.1 C57_LPF-ADC2.1 U7_LPF-ADC2.11 U7_LPF-ADC2.17), LPF-ADC1 (C56_LPF-ADC1.1 C57_LPF-ADC1.1 U7_LPF-ADC1.11 U7_LPF-ADC1.17)
ADC_IN_N: LPF-ADC2 (U7_LPF-ADC2.19), ADC2 (U8_ADC2.22)
ADC_IN_N: LPF-ADC1 (U7_LPF-ADC1.19), ADC1 (U8_ADC1.22)
ADC_IN_P: LPF-ADC2 (U7_LPF-ADC2.18), ADC2 (U8_ADC2.23)
ADC_IN_P: LPF-ADC1 (U7_LPF-ADC1.18), ADC1 (U8_ADC1.23)
~{CE}2_3V3: Connectors_Frontend (P1.2), Buffers (R84.2)
CLK_ASIC_SPI_3V3: Connectors_Frontend (P1.14), Buffers (R85.2)
DAC_3V3_D0: DAC (R4.2), Buffers (U19.22)
DAC_3V3_D1: DAC (R4.3), Buffers (U19.20)
DAC_3V3_D2: DAC (R4.4), Buffers (U19.19)
DAC_3V3_D3: DAC (R4.5), Buffers (U19.17)
DAC_3V3_D4: DAC (R4.6), Buffers (U19.16)
DAC_3V3_D5: DAC (R4.7), Buffers (U19.14)
DAC_3V3_D6: DAC (R4.8), Buffers (U19.13)
DAC_3V3_D7: DAC (R10.1), Buffers (U19.12)
DAC_3V3_D8: DAC (R10.2), Buffers (U19.11)
DAC_3V3_D9: DAC (R10.3), Buffers (U19.9)
DAC_3V3_D10: DAC (R10.4), Buffers (U19.8)
DAC_3V3_D11: DAC (R10.5), Buffers (U19.6)
DAC_3V3_D12: DAC (R10.6), Buffers (U19.5)
DAC_3V3_D13: DAC (R10.7), Buffers (U19.3)
DATA_ASIC_SPI_3V3: Connectors_Frontend (P1.11), Buffers (R83.2)
I_N: Connectors_Frontend (P1.10), LPF-ADC2 (C44_LPF-ADC2.1)
I_P: Connectors_Frontend (P1.1), LPF-ADC2 (C49_LPF-ADC2.1)
NetR4_1: DAC (R4.1), Buffers (U19.23)
Q_N: Connectors_Frontend (P1.8), LPF-ADC1 (C44_LPF-ADC1.1)
Q_P: Connectors_Frontend (P1.9), LPF-ADC1 (C49_LPF-ADC1.1)